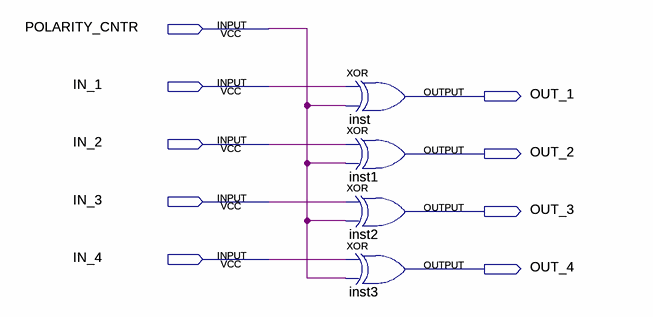
[diagram p0: schematic sheet]
// Quartus schematic Polarity_inverter.bdf as structural Verilog: 8 symbols, 18 pins
module Polarity_inverter (
  input  POLARITY_CNTR,
  input  IN_1,
  input  IN_2,
  input  IN_3,
  input  IN_4,
  output OUT_1,
  output OUT_2,
  output OUT_3,
  output OUT_4
);

  xor inst (OUT_1, IN_1, POLARITY_CNTR);
  xor inst_dup2 (OUT_1, IN_1, POLARITY_CNTR);
  xor inst1 (OUT_2, IN_2, POLARITY_CNTR);
  xor inst1_dup2 (OUT_2, IN_2, POLARITY_CNTR);
  xor inst2 (OUT_3, IN_3, POLARITY_CNTR);
  xor inst2_dup2 (OUT_3, IN_3, POLARITY_CNTR);
  xor inst3 (OUT_4, IN_4, POLARITY_CNTR);
  xor inst3_dup2 (OUT_4, IN_4, POLARITY_CNTR);
endmodule
